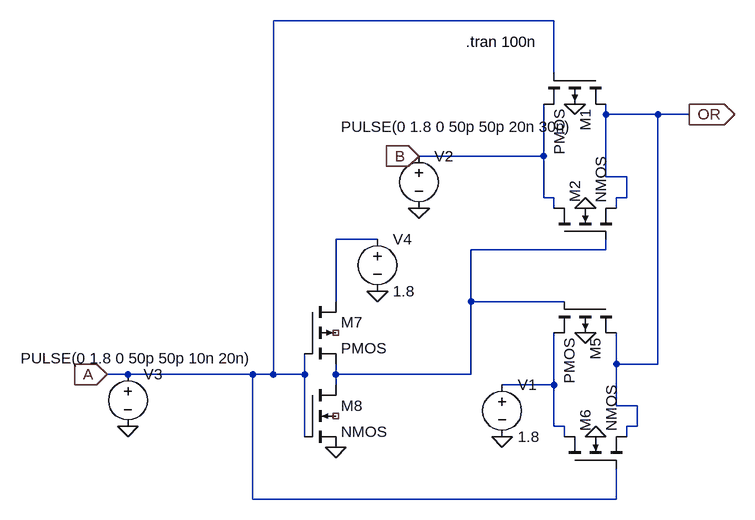
[diagram p0: schematic OR.asc]
OR.asc, the LTspice schematic file:
Version 4.1
SHEET 1 880 756
WIRE 208 16 -224 16
WIRE 208 96 208 16
WIRE 288 160 288 144
WIRE 368 160 288 160
WIRE 416 160 368 160
WIRE 192 224 192 144
WIRE 192 224 0 224
WIRE 288 256 288 160
WIRE 320 256 288 256
WIRE 192 288 192 224
WIRE 208 288 192 288
WIRE 320 288 320 256
WIRE 320 288 304 288
WIRE 208 304 208 288
WIRE 304 304 304 288
WIRE -64 352 -128 352
WIRE 288 368 288 352
WIRE 288 368 80 368
WIRE -128 448 -128 352
WIRE 80 448 80 368
WIRE 224 448 80 448
WIRE 304 544 304 496
WIRE 368 544 368 160
WIRE 368 544 304 544
WIRE -448 560 -480 560
WIRE -256 560 -448 560
WIRE -224 560 -224 16
WIRE -224 560 -256 560
WIRE -176 560 -176 528
WIRE -176 560 -224 560
WIRE -128 560 -128 544
WIRE 80 560 80 448
WIRE 80 560 -128 560
WIRE -128 576 -128 560
WIRE 208 576 208 496
WIRE 208 576 128 576
WIRE 304 608 304 544
WIRE 336 608 304 608
WIRE 208 640 208 576
WIRE 224 640 208 640
WIRE 336 640 336 608
WIRE 336 640 320 640
WIRE -176 656 -176 560
WIRE 224 656 224 640
WIRE 320 656 320 640
WIRE -256 752 -256 560
WIRE 304 752 304 704
WIRE 304 752 -256 752
FLAG -480 560 A
IOPIN -480 560 In
FLAG -448 640 0
FLAG 0 304 0
FLAG 0 224 B
IOPIN 0 224 In
FLAG 416 160 OR
IOPIN 416 160 Out
FLAG 240 144 0
FLAG 256 304 0
FLAG 256 496 0
FLAG 272 656 0
FLAG -128 672 0
FLAG -64 432 0
FLAG 128 656 0
SYMBOL pmos4 288 96 R90
SYMATTR InstName M1
SYMBOL nmos4 208 352 R270
SYMATTR InstName M2
SYMBOL voltage 0 208 R0
WINDOW 3 -120 -29 Left 2
WINDOW 123 0 0 Left 0
WINDOW 39 0 0 Left 0
SYMATTR Value PULSE(0 1.8 0 50p 50p 20n 30n)
SYMATTR InstName V2
SYMBOL voltage -448 544 R0
WINDOW 3 -165 -9 Left 2
WINDOW 123 0 0 Left 0
WINDOW 39 0 0 Left 0
SYMATTR Value PULSE(0 1.8 0 50p 50p 10n 20n)
SYMATTR InstName V3
SYMBOL pmos4 304 448 R90
SYMATTR InstName M5
SYMBOL nmos4 224 704 R270
SYMATTR InstName M6
SYMBOL pmos4 -176 448 R0
SYMATTR InstName M7
SYMBOL nmos4 -176 576 R0
SYMATTR InstName M8
SYMBOL voltage -64 336 R0
WINDOW 123 0 0 Left 0
WINDOW 39 0 0 Left 0
SYMATTR InstName V4
SYMATTR Value 1.8
SYMBOL voltage 128 560 R0
WINDOW 123 0 0 Left 0
WINDOW 39 0 0 Left 0
SYMATTR InstName V1
SYMATTR Value 1.8
TEXT 72 48 Left 2 !.tran 100n

The netlist it stands for:
* OR.asc
M1 OR A B 0 PMOS
M2 B N002 OR 0 NMOS
V2 B 0 PULSE(0 1.8 0 50p 50p 20n 30n)
V3 A 0 PULSE(0 1.8 0 50p 50p 10n 20n)
M5 OR N002 N003 0 PMOS
M6 N003 A OR 0 NMOS
M7 N001 A N002 NC_01 PMOS
M8 N002 A 0 NC_02 NMOS
V4 N001 0 1.8
V1 N003 0 1.8
.model NMOS NMOS
.model PMOS PMOS
.lib standard.mos
.tran 100n
.backanno
.end